# Altium schematic sheet SHDN-BSPD-S03-V00-Connectivity.SchDoc
size A4
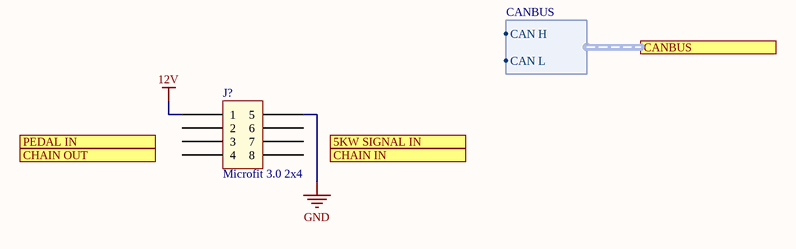
[diagram p0: SHDN-BSPD-S03-V00-Connectivity.SchDoc]

## Parts
J?  Microfit 3.0 2x4  [Microfit_2X4_R_TH]

## Ports
5KW SIGNAL IN (out), CANBUS (harness CANBUS), CHAIN IN (out), CHAIN OUT (in), PEDAL IN (out)

## Harnesses
CANBUS: CAN H, CAN L

## Nets
12V: J?.1
GND: J?.5

Not connected (* = marked no-connect by the designer): J? 2 3 4 6 7 8

## Library data of the parts
J? = Microfit_2x4